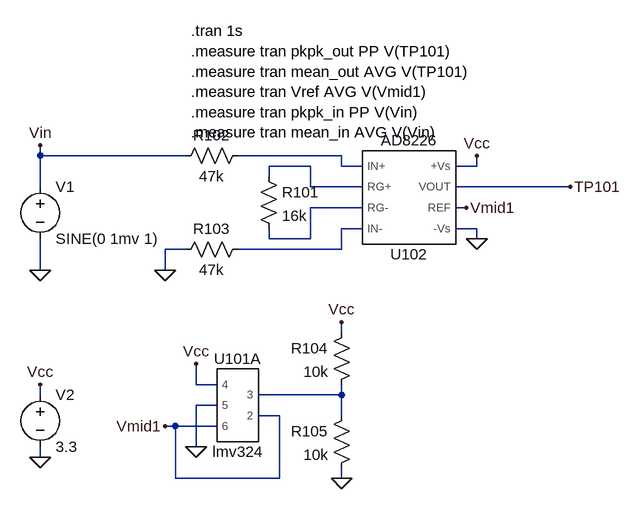
[diagram p0: schematic Input_Stage.asc]
Input_Stage.asc, the LTspice schematic file:
Version 4
SHEET 1 1220 752
WIRE -192 224 -192 208
WIRE 32 224 -192 224
WIRE 272 224 112 224
WIRE 224 240 160 240
WIRE 272 240 272 224
WIRE 304 240 272 240
WIRE 480 240 480 224
WIRE 480 240 448 240
WIRE 160 256 160 240
WIRE -192 272 -192 224
WIRE 224 272 224 240
WIRE 304 272 224 272
WIRE 624 272 448 272
WIRE 304 304 224 304
WIRE 464 304 448 304
WIRE 304 336 272 336
WIRE 480 336 448 336
WIRE 160 352 160 336
WIRE 224 352 224 304
WIRE 224 352 160 352
WIRE 480 352 480 336
WIRE 32 368 0 368
WIRE 272 368 272 336
WIRE 272 368 112 368
WIRE -192 400 -192 352
WIRE 0 400 0 368
WIRE 272 496 272 480
WIRE 48 576 48 544
WIRE 80 576 48 576
WIRE -192 592 -192 576
WIRE 272 592 272 576
WIRE 272 592 144 592
WIRE 80 608 48 608
WIRE 176 624 144 624
WIRE 272 624 272 592
WIRE 16 640 0 640
WIRE 80 640 16 640
WIRE 48 672 48 608
WIRE -192 688 -192 672
WIRE 16 720 16 640
WIRE 176 720 176 624
WIRE 176 720 16 720
WIRE 272 720 272 704
FLAG 0 400 0
FLAG -192 688 0
FLAG -192 576 Vcc
FLAG -192 400 0
FLAG -192 208 Vin
FLAG 480 352 0
FLAG 480 224 Vcc
FLAG 464 304 Vmid1
FLAG 48 544 Vcc
FLAG 48 672 0
FLAG 0 640 Vmid1
FLAG 272 720 0
FLAG 272 480 Vcc
FLAG 624 272 TP101
SYMBOL ad8226 368 288 M180
SYMATTR InstName U102
SYMBOL res 144 240 R0
SYMATTR InstName R101
SYMATTR Value 16k
SYMBOL res 128 208 R90
WINDOW 0 0 56 VBottom 2
WINDOW 3 32 56 VTop 2
SYMATTR InstName R102
SYMATTR Value 47k
SYMBOL res 128 352 R90
WINDOW 0 0 56 VBottom 2
WINDOW 3 32 56 VTop 2
SYMATTR InstName R103
SYMATTR Value 47k
SYMBOL voltage -192 256 R0
SYMATTR InstName V1
SYMATTR Value SINE(0 1mv 1)
SYMBOL voltage -192 576 R0
SYMATTR InstName V2
SYMATTR Value 3.3
SYMBOL LMV324 112 608 M0
SYMATTR InstName U101A
SYMBOL res 288 480 M0
SYMATTR InstName R104
SYMATTR Value 10k
SYMBOL res 288 608 M0
SYMATTR InstName R105
SYMATTR Value 10k
TEXT 40 32 Left 2 !.tran 1s\n.measure tran pkpk_out PP V(TP101)\n.measure tran mean_out AVG V(TP101)\n.measure tran Vref AVG V(Vmid1)\n.measure tran pkpk_in PP V(Vin)\n.measure tran mean_in AVG V(Vin)

The netlist it stands for:
* Input_Stage.asc
XU102 N004 N003 N002 N001 0 Vmid1 TP101 Vcc AD8226  ; pins IN- RG- RG+ IN+ -Vs REF VOUT +Vs
R101 N002 N003 16k
R102 N001 Vin 47k
R103 N004 0 47k
V1 Vin 0 SINE(0 1mv 1)
V2 Vcc 0 3.3
XU101A N005 Vmid1 Vcc 0 Vmid1 lmv324  ; pins 3 2 4 5 6
R104 Vcc N005 10k
R105 N005 0 10k
.tran 1s
.measure tran pkpk_out PP V(TP101)
.measure tran mean_out AVG V(TP101)
.measure tran Vref AVG V(Vmid1)
.measure tran pkpk_in PP V(Vin)
.measure tran mean_in AVG V(Vin)
.lib /Users/matthollands/Library/Mobile Documents/com~apple~CloudDocs/PersonalProjects/EOGee/Github/EOGee/EOGee1/LTSpice_Model/ad8226.cir
.lib /Users/matthollands/Library/Mobile Documents/com~apple~CloudDocs/PersonalProjects/EOGee/Github/EOGee/EOGee1/LTSpice_Model/LMV324.cir
.backanno
.end